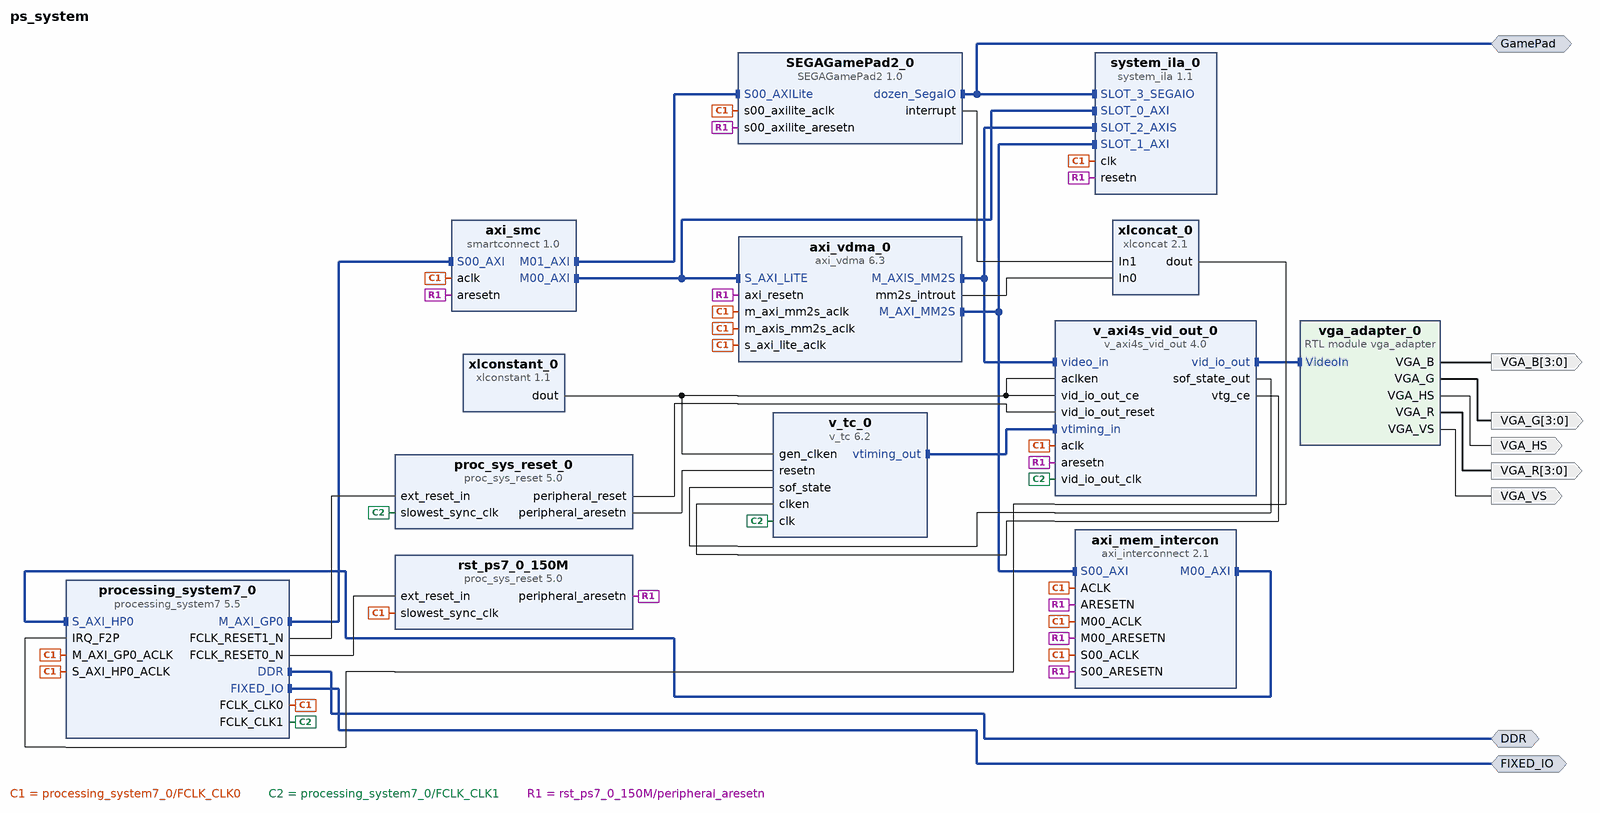
[diagram p0: block diagram of the top level]
# Vivado block design ps_system, xc7z020clg484-1, Vivado 2024.2
create_bd_design ps_system

create_bd_intf_port -mode Master -vlnv xilinx.com:interface:ddrx_rtl:1.0 DDR
create_bd_intf_port -mode Master -vlnv xilinx.com:display_processing_system7:fixedio_rtl:1.0 FIXED_IO
create_bd_intf_port -mode Master -vlnv Redacted:dozen:SegaIO_rtl:1.0 GamePad
create_bd_port -dir O -from 3 -to 0 VGA_R
create_bd_port -dir O -from 3 -to 0 VGA_G
create_bd_port -dir O -from 3 -to 0 VGA_B
create_bd_port -dir O VGA_HS
create_bd_port -dir O VGA_VS

create_bd_cell -type ip -vlnv xilinx.com:ip:processing_system7:5.5 processing_system7_0
set_property -dict [list \
  CONFIG.PCW_APU_PERIPHERAL_FREQMHZ 666.666667 \
  CONFIG.PCW_ENET0_PERIPHERAL_ENABLE 0 \
  CONFIG.PCW_EN_CLK1_PORT 1 \
  CONFIG.PCW_EN_RST1_PORT 1 \
  CONFIG.PCW_FCLK_CLK1_BUF TRUE \
  CONFIG.PCW_FPGA0_PERIPHERAL_FREQMHZ 150.000000 \
  CONFIG.PCW_FPGA1_PERIPHERAL_FREQMHZ 25 \
  CONFIG.PCW_FPGA_FCLK1_ENABLE 1 \
  CONFIG.PCW_GPIO_MIO_GPIO_ENABLE 1 \
  CONFIG.PCW_GPIO_MIO_GPIO_IO MIO \
  CONFIG.PCW_I2C_RESET_ENABLE 1 \
  CONFIG.PCW_IRQ_F2P_INTR 1 \
  CONFIG.PCW_PERIPHERAL_BOARD_PRESET part0 \
  CONFIG.PCW_PRESET_BANK1_VOLTAGE {LVCMOS 1.8V} \
  CONFIG.PCW_QSPI_GRP_SINGLE_SS_ENABLE 1 \
  CONFIG.PCW_QSPI_GRP_SINGLE_SS_IO {MIO 1 .. 6} \
  CONFIG.PCW_QSPI_PERIPHERAL_ENABLE 1 \
  CONFIG.PCW_QSPI_QSPI_IO {MIO 1 .. 6} \
  CONFIG.PCW_SD0_GRP_CD_ENABLE 1 \
  CONFIG.PCW_SD0_GRP_CD_IO {MIO 47} \
  CONFIG.PCW_SD0_GRP_WP_ENABLE 1 \
  CONFIG.PCW_SD0_GRP_WP_IO {MIO 46} \
  CONFIG.PCW_SD0_PERIPHERAL_ENABLE 1 \
  CONFIG.PCW_SD0_SD0_IO {MIO 40 .. 45} \
  CONFIG.PCW_SDIO_PERIPHERAL_FREQMHZ 50 \
  CONFIG.PCW_SINGLE_QSPI_DATA_MODE x4 \
  CONFIG.PCW_UART1_PERIPHERAL_ENABLE 1 \
  CONFIG.PCW_UART1_UART1_IO {MIO 48 .. 49} \
  CONFIG.PCW_UART_PERIPHERAL_FREQMHZ 50 \
  CONFIG.PCW_UIPARAM_DDR_FREQ_MHZ 533.333313 \
  CONFIG.PCW_UIPARAM_DDR_PARTNO {MT41J128M16 HA-15E} \
  CONFIG.PCW_USB0_PERIPHERAL_ENABLE 1 \
  CONFIG.PCW_USB0_RESET_ENABLE 0 \
  CONFIG.PCW_USB0_USB0_IO {MIO 28 .. 39} \
  CONFIG.PCW_USB_RESET_ENABLE 1 \
  CONFIG.PCW_USB_RESET_SELECT {Share reset pin} \
  CONFIG.PCW_USE_FABRIC_INTERRUPT 1 \
  CONFIG.PCW_USE_S_AXI_HP0 1 \
  CONFIG.preset ZedBoard \
] [get_bd_cells processing_system7_0]
# 223 more settings of processing_system7_0 are not shown: defaults, MIO pin electricals, DDR timing, and values the tool derives
create_bd_cell -type ip -vlnv xilinx.com:ip:v_axi4s_vid_out:4.0 v_axi4s_vid_out_0
set_property -dict [list \
  CONFIG.C_HAS_ASYNC_CLK 1 \
  CONFIG.C_S_AXIS_VIDEO_DATA_WIDTH 8 \
  CONFIG.C_S_AXIS_VIDEO_FORMAT 2 \
] [get_bd_cells v_axi4s_vid_out_0]
create_bd_cell -type ip -vlnv xilinx.com:ip:axi_vdma:6.3 axi_vdma_0
set_property -dict [list \
  CONFIG.c_include_s2mm 0 \
  CONFIG.c_m_axis_mm2s_tdata_width 24 \
  CONFIG.c_mm2s_max_burst_length 32 \
  CONFIG.c_num_fstores 2 \
] [get_bd_cells axi_vdma_0]
create_bd_cell -type ip -vlnv xilinx.com:ip:v_tc:6.2 v_tc_0
set_property -dict [list \
  CONFIG.GEN_HSYNC_POLARITY Low \
  CONFIG.GEN_VSYNC_POLARITY Low \
  CONFIG.HAS_AXI4_LITE false \
  CONFIG.VIDEO_MODE 480p \
  CONFIG.enable_detection false \
] [get_bd_cells v_tc_0]
create_bd_cell -type module -reference vga_adapter vga_adapter_0
create_bd_cell -type ip -vlnv xilinx.com:ip:xlconstant:1.1 xlconstant_0
create_bd_cell -type ip -vlnv xilinx.com:ip:system_ila:1.1 system_ila_0
set_property -dict [list \
  CONFIG.C_NUM_MONITOR_SLOTS 4 \
  CONFIG.C_SLOT 3 \
  CONFIG.C_SLOT_0_AXI_AW_SEL_DATA 0 \
  CONFIG.C_SLOT_0_AXI_AW_SEL_TRIG 0 \
  CONFIG.C_SLOT_0_AXI_B_SEL_DATA 0 \
  CONFIG.C_SLOT_0_AXI_B_SEL_TRIG 0 \
  CONFIG.C_SLOT_0_AXI_R_SEL_TRIG 0 \
  CONFIG.C_SLOT_0_AXI_W_SEL_DATA 0 \
  CONFIG.C_SLOT_0_AXI_W_SEL_TRIG 0 \
  CONFIG.C_SLOT_1_AXI_AW_SEL_DATA 0 \
  CONFIG.C_SLOT_1_AXI_AW_SEL_TRIG 0 \
  CONFIG.C_SLOT_1_AXI_B_SEL_DATA 0 \
  CONFIG.C_SLOT_1_AXI_B_SEL_TRIG 0 \
  CONFIG.C_SLOT_1_AXI_R_SEL_TRIG 0 \
  CONFIG.C_SLOT_1_AXI_W_SEL_DATA 0 \
  CONFIG.C_SLOT_1_AXI_W_SEL_TRIG 0 \
  CONFIG.C_SLOT_2_INTF_TYPE xilinx.com:interface:axis_rtl:1.0 \
  CONFIG.C_SLOT_3_INTF_TYPE Redacted:dozen:SegaIO_rtl:1.0 \
  CONFIG.C_SLOT_3_TYPE 0 \
] [get_bd_cells system_ila_0]
create_bd_cell -type ip -vlnv xilinx.com:ip:smartconnect:1.0 axi_smc
set_property -dict {CONFIG.NUM_MI 2 CONFIG.NUM_SI 1} [get_bd_cells axi_smc]
create_bd_cell -type ip -vlnv xilinx.com:ip:proc_sys_reset:5.0 rst_ps7_0_150M
create_bd_cell -type ip -vlnv xilinx.com:ip:axi_interconnect:2.1 axi_mem_intercon
set_property -dict {CONFIG.NUM_MI 1} [get_bd_cells axi_mem_intercon]
create_bd_cell -type ip -vlnv xilinx.com:ip:proc_sys_reset:5.0 proc_sys_reset_0
create_bd_cell -type ip -vlnv xilinx.com:ip:xlconcat:2.1 xlconcat_0
create_bd_cell -type ip -vlnv Redacted:dozen:SEGAGamePad2:1.0 SEGAGamePad2_0

# ---- connections ----

connect_bd_intf_net [get_bd_intf_ports GamePad] [get_bd_intf_pins SEGAGamePad2_0/dozen_SegaIO]
connect_bd_intf_net [get_bd_intf_ports GamePad] [get_bd_intf_pins system_ila_0/SLOT_3_SEGAIO]
connect_bd_intf_net [get_bd_intf_pins axi_mem_intercon/M00_AXI] [get_bd_intf_pins processing_system7_0/S_AXI_HP0]
connect_bd_intf_net [get_bd_intf_pins axi_smc/M00_AXI] [get_bd_intf_pins axi_vdma_0/S_AXI_LITE]
connect_bd_intf_net [get_bd_intf_pins axi_smc/M00_AXI] [get_bd_intf_pins system_ila_0/SLOT_0_AXI]
connect_bd_intf_net [get_bd_intf_pins axi_smc/M01_AXI] [get_bd_intf_pins SEGAGamePad2_0/S00_AXILite]
connect_bd_intf_net [get_bd_intf_pins axi_vdma_0/M_AXIS_MM2S] [get_bd_intf_pins v_axi4s_vid_out_0/video_in]
connect_bd_intf_net [get_bd_intf_pins axi_vdma_0/M_AXIS_MM2S] [get_bd_intf_pins system_ila_0/SLOT_2_AXIS]
connect_bd_intf_net [get_bd_intf_pins axi_vdma_0/M_AXI_MM2S] [get_bd_intf_pins axi_mem_intercon/S00_AXI]
connect_bd_intf_net [get_bd_intf_pins axi_vdma_0/M_AXI_MM2S] [get_bd_intf_pins system_ila_0/SLOT_1_AXI]
connect_bd_intf_net [get_bd_intf_ports DDR] [get_bd_intf_pins processing_system7_0/DDR]
connect_bd_intf_net [get_bd_intf_ports FIXED_IO] [get_bd_intf_pins processing_system7_0/FIXED_IO]
connect_bd_intf_net [get_bd_intf_pins processing_system7_0/M_AXI_GP0] [get_bd_intf_pins axi_smc/S00_AXI]
connect_bd_intf_net [get_bd_intf_pins v_axi4s_vid_out_0/vid_io_out] [get_bd_intf_pins vga_adapter_0/VideoIn]
connect_bd_intf_net [get_bd_intf_pins v_tc_0/vtiming_out] [get_bd_intf_pins v_axi4s_vid_out_0/vtiming_in]
connect_bd_net [get_bd_pins SEGAGamePad2_0/interrupt] [get_bd_pins xlconcat_0/In1]
connect_bd_net [get_bd_pins axi_vdma_0/mm2s_introut] [get_bd_pins xlconcat_0/In0]
connect_bd_net [get_bd_pins proc_sys_reset_0/peripheral_aresetn] [get_bd_pins v_tc_0/resetn]
connect_bd_net [get_bd_pins proc_sys_reset_0/peripheral_reset] [get_bd_pins v_axi4s_vid_out_0/vid_io_out_reset]
connect_bd_net [get_bd_pins processing_system7_0/FCLK_CLK0] \
  [get_bd_pins axi_vdma_0/s_axi_lite_aclk] [get_bd_pins axi_vdma_0/m_axi_mm2s_aclk] [get_bd_pins axi_mem_intercon/ACLK] \
  [get_bd_pins axi_mem_intercon/S00_ACLK] [get_bd_pins axi_mem_intercon/M00_ACLK] [get_bd_pins v_axi4s_vid_out_0/aclk] \
  [get_bd_pins system_ila_0/clk] [get_bd_pins axi_vdma_0/m_axis_mm2s_aclk] [get_bd_pins axi_smc/aclk] \
  [get_bd_pins processing_system7_0/M_AXI_GP0_ACLK] [get_bd_pins processing_system7_0/S_AXI_HP0_ACLK] \
  [get_bd_pins rst_ps7_0_150M/slowest_sync_clk] [get_bd_pins SEGAGamePad2_0/s00_axilite_aclk]
connect_bd_net [get_bd_pins processing_system7_0/FCLK_CLK1] \
  [get_bd_pins v_tc_0/clk] [get_bd_pins v_axi4s_vid_out_0/vid_io_out_clk] [get_bd_pins proc_sys_reset_0/slowest_sync_clk]
connect_bd_net [get_bd_pins processing_system7_0/FCLK_RESET0_N] [get_bd_pins rst_ps7_0_150M/ext_reset_in]
connect_bd_net [get_bd_pins processing_system7_0/FCLK_RESET1_N] [get_bd_pins proc_sys_reset_0/ext_reset_in]
connect_bd_net [get_bd_pins rst_ps7_0_150M/peripheral_aresetn] \
  [get_bd_pins axi_vdma_0/axi_resetn] [get_bd_pins axi_mem_intercon/S00_ARESETN] [get_bd_pins axi_mem_intercon/M00_ARESETN] \
  [get_bd_pins axi_mem_intercon/ARESETN] [get_bd_pins v_axi4s_vid_out_0/aresetn] [get_bd_pins system_ila_0/resetn] \
  [get_bd_pins axi_smc/aresetn] [get_bd_pins SEGAGamePad2_0/s00_axilite_aresetn]
connect_bd_net [get_bd_pins v_axi4s_vid_out_0/sof_state_out] [get_bd_pins v_tc_0/sof_state]
connect_bd_net [get_bd_pins v_axi4s_vid_out_0/vtg_ce] [get_bd_pins v_tc_0/clken]
connect_bd_net [get_bd_pins vga_adapter_0/VGA_B] [get_bd_ports VGA_B]
connect_bd_net [get_bd_pins vga_adapter_0/VGA_G] [get_bd_ports VGA_G]
connect_bd_net [get_bd_pins vga_adapter_0/VGA_HS] [get_bd_ports VGA_HS]
connect_bd_net [get_bd_pins vga_adapter_0/VGA_R] [get_bd_ports VGA_R]
connect_bd_net [get_bd_pins vga_adapter_0/VGA_VS] [get_bd_ports VGA_VS]
connect_bd_net [get_bd_pins xlconcat_0/dout] [get_bd_pins processing_system7_0/IRQ_F2P]
connect_bd_net [get_bd_pins xlconstant_0/dout] \
  [get_bd_pins v_tc_0/gen_clken] [get_bd_pins v_axi4s_vid_out_0/aclken] [get_bd_pins v_axi4s_vid_out_0/vid_io_out_ce]

# ---- address map ----
assign_bd_address -offset 0x00000000 -range 512M -target_address_space [get_bd_addr_spaces axi_vdma_0/Data_MM2S] [get_bd_addr_segs processing_system7_0/S_AXI_HP0/HP0_DDR_LOWOCM]
assign_bd_address -offset 0x43000000 -range 64K -target_address_space [get_bd_addr_spaces processing_system7_0/Data] [get_bd_addr_segs axi_vdma_0/S_AXI_LITE/Reg]
assign_bd_address -offset 0x43C00000 -range 64K -target_address_space [get_bd_addr_spaces processing_system7_0/Data] [get_bd_addr_segs SEGAGamePad2_0/S00_AXILite/S00_AXILite_reg]

validate_bd_design
save_bd_design
